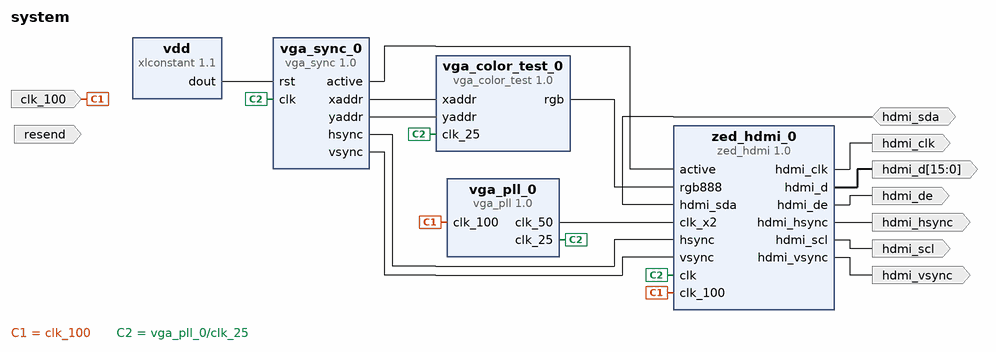
[diagram p0: block diagram of the top level]
# Vivado block design system, xc7z020clg484-1, Vivado 2016.4
create_bd_design system

create_bd_port -dir O -type clk hdmi_clk
create_bd_port -dir O hdmi_hsync
create_bd_port -dir O hdmi_vsync
create_bd_port -dir O -from 15 -to 0 hdmi_d
create_bd_port -dir O hdmi_de
create_bd_port -dir O hdmi_scl
create_bd_port -dir IO hdmi_sda
create_bd_port -dir I clk_100
create_bd_port -dir I resend

create_bd_cell -type ip -vlnv xilinx.com:user:vga_color_test:1.0 vga_color_test_0
create_bd_cell -type ip -vlnv xilinx.com:ip:xlconstant:1.1 vdd
create_bd_cell -type ip -vlnv xilinx.com:user:vga_pll:1.0 vga_pll_0
create_bd_cell -type ip -vlnv xilinx.com:user:vga_sync:1.0 vga_sync_0
create_bd_cell -type ip -vlnv xilinx.com:user:zed_hdmi:1.0 zed_hdmi_0

# ---- connections ----

connect_bd_net [get_bd_pins zed_hdmi_0/hdmi_clk] [get_bd_ports hdmi_clk]
connect_bd_net [get_bd_pins zed_hdmi_0/hdmi_hsync] [get_bd_ports hdmi_hsync]
connect_bd_net [get_bd_pins zed_hdmi_0/hdmi_vsync] [get_bd_ports hdmi_vsync]
connect_bd_net [get_bd_pins zed_hdmi_0/hdmi_d] [get_bd_ports hdmi_d]
connect_bd_net [get_bd_pins zed_hdmi_0/hdmi_de] [get_bd_ports hdmi_de]
connect_bd_net [get_bd_pins zed_hdmi_0/hdmi_scl] [get_bd_ports hdmi_scl]
connect_bd_net [get_bd_ports hdmi_sda] [get_bd_pins zed_hdmi_0/hdmi_sda]
connect_bd_net -net clk_100_1 [get_bd_ports clk_100] [get_bd_pins vga_pll_0/clk_100] [get_bd_pins zed_hdmi_0/clk_100]
connect_bd_net [get_bd_pins vga_sync_0/active] [get_bd_pins zed_hdmi_0/active]
connect_bd_net [get_bd_pins vga_sync_0/xaddr] [get_bd_pins vga_color_test_0/xaddr]
connect_bd_net [get_bd_pins vga_sync_0/yaddr] [get_bd_pins vga_color_test_0/yaddr]
connect_bd_net [get_bd_pins vga_color_test_0/rgb] [get_bd_pins zed_hdmi_0/rgb888]
connect_bd_net [get_bd_pins vdd/dout] [get_bd_pins vga_sync_0/rst]
connect_bd_net [get_bd_pins vga_sync_0/hsync] [get_bd_pins zed_hdmi_0/hsync]
connect_bd_net [get_bd_pins vga_sync_0/vsync] [get_bd_pins zed_hdmi_0/vsync]
# net resend_1 has one end: resend
connect_bd_net [get_bd_pins vga_pll_0/clk_25] [get_bd_pins vga_color_test_0/clk_25] [get_bd_pins vga_sync_0/clk] [get_bd_pins zed_hdmi_0/clk]
connect_bd_net [get_bd_pins vga_pll_0/clk_50] [get_bd_pins zed_hdmi_0/clk_x2]

validate_bd_design
save_bd_design
